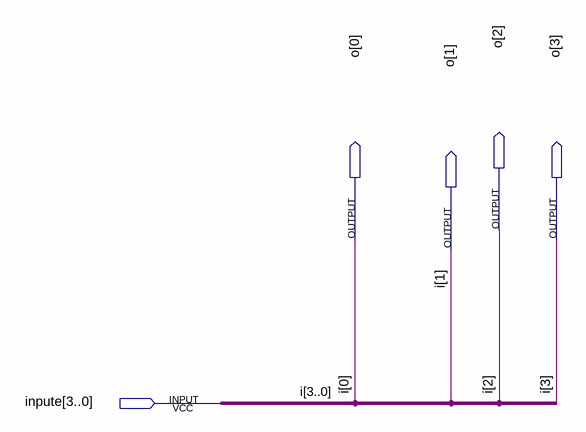
[diagram p0: schematic sheet]
// Quartus schematic fanout4.bdf as structural Verilog: 0 symbols, 5 pins
module fanout4 (
  input  [3:0] inpute,
  output [3:0] o
);


  assign o = inpute;

  // Other names for the same wires on the sheet: i[3:0] = inpute
endmodule
